# Altium schematic sheet Boom Deployment.SchDoc
size A3; SheetNumber: 5; SheetTotal: 5
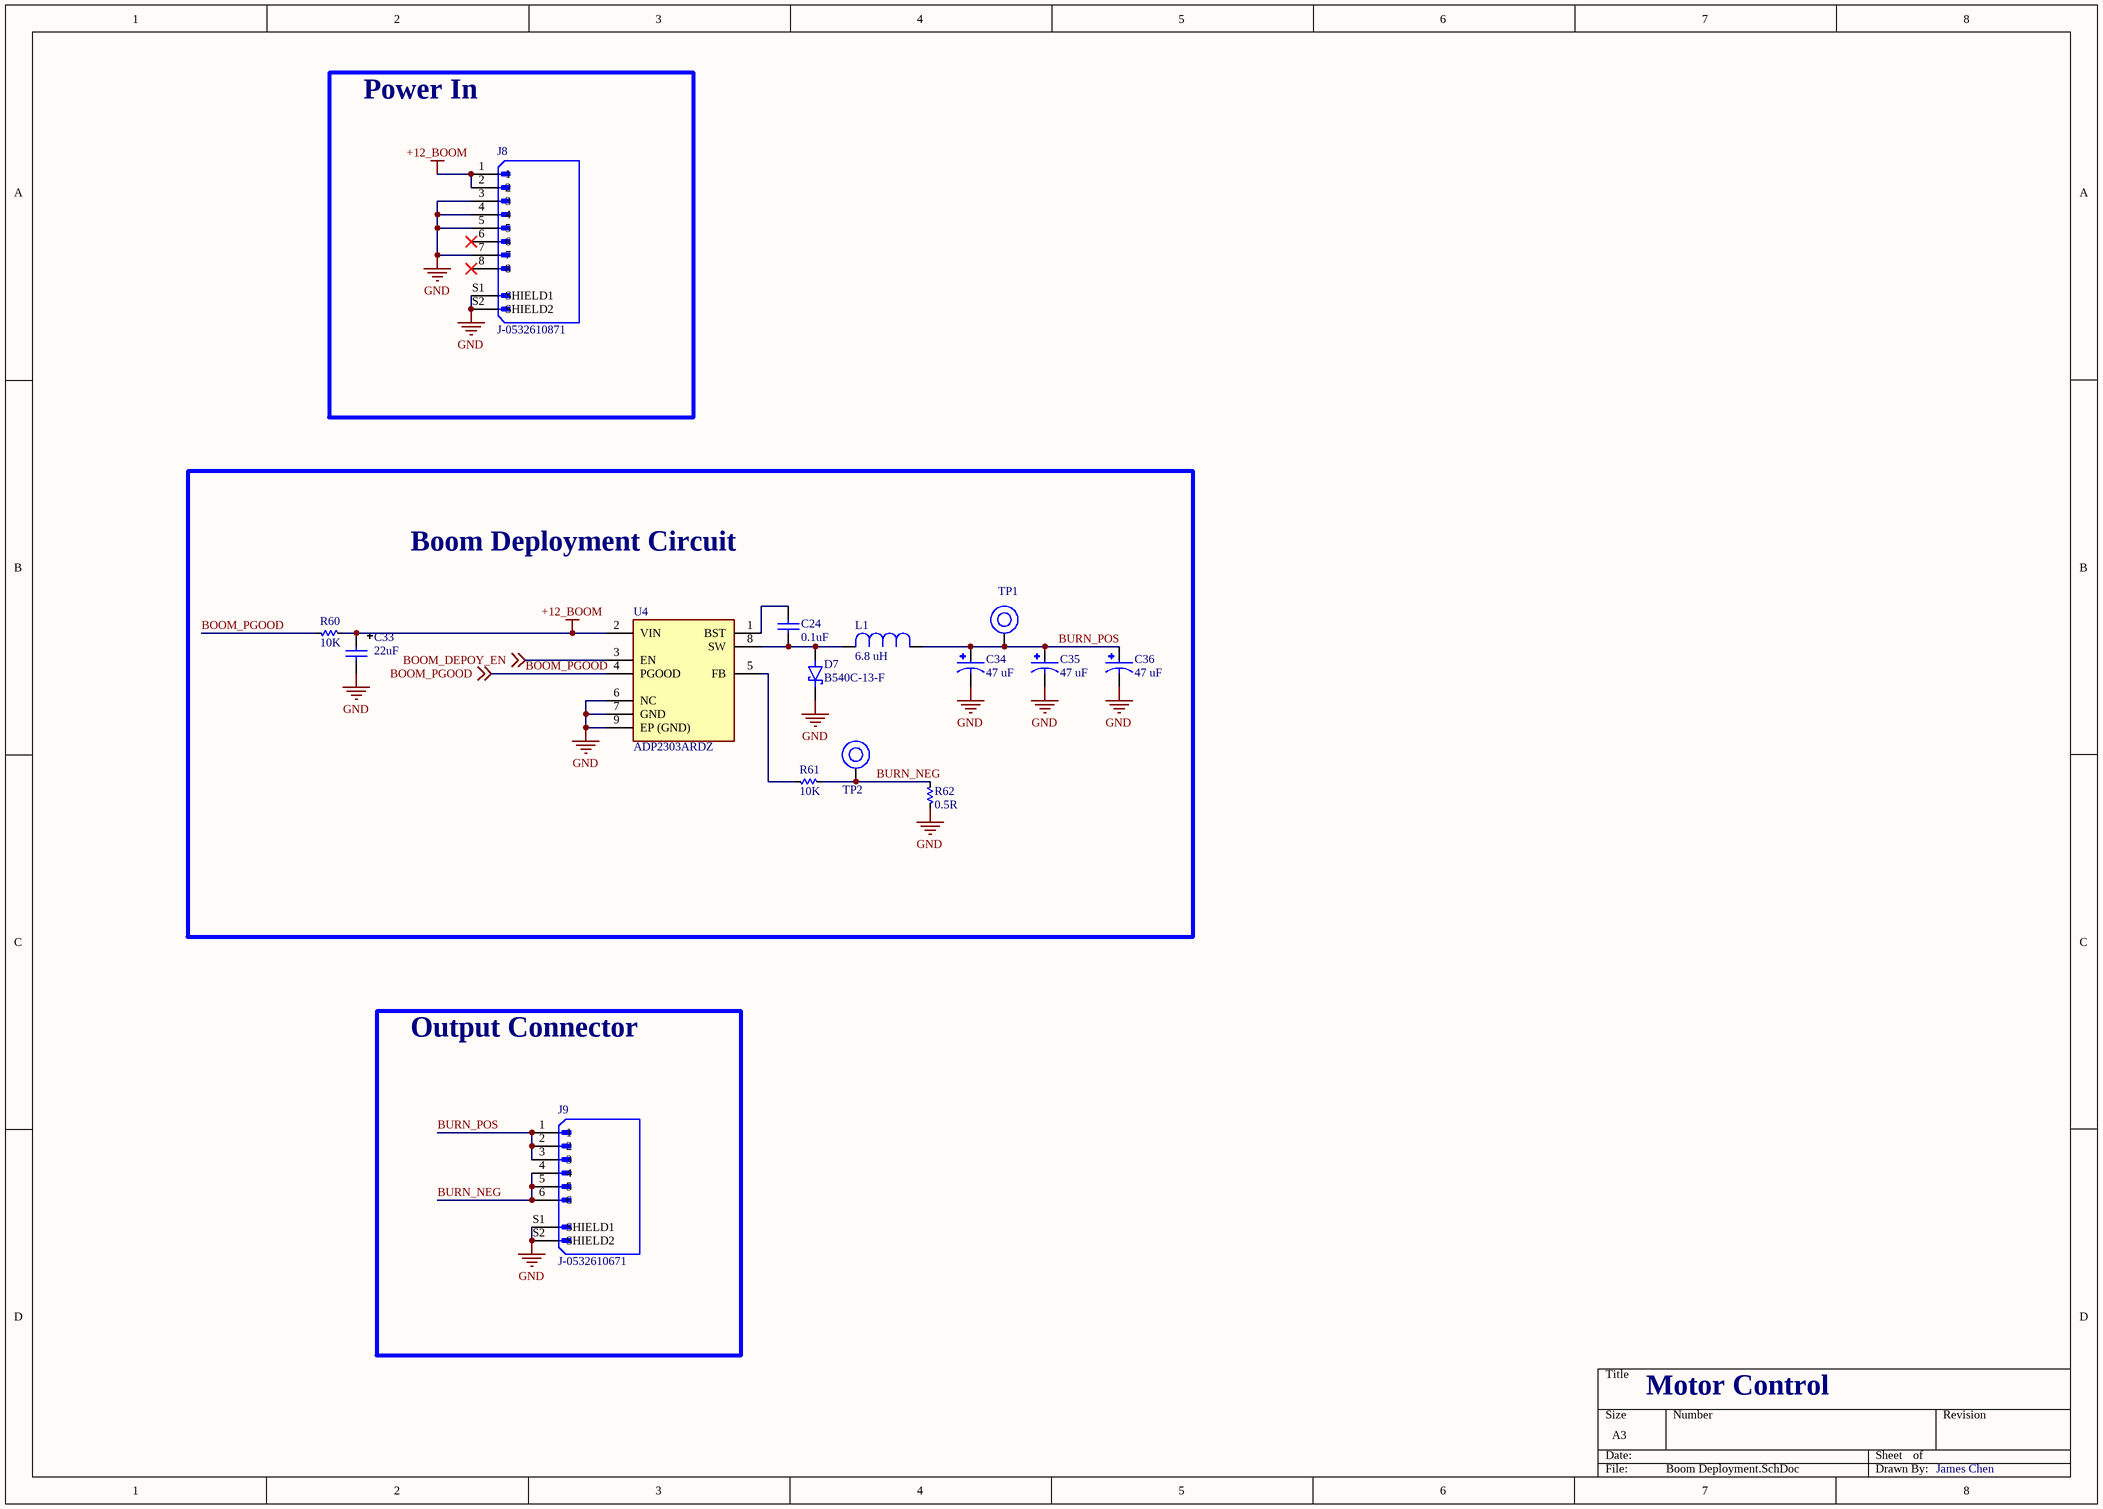
[diagram p0: Boom Deployment.SchDoc]

## Parts
C24  0.1uF  [0603]
C33  22uF  [CAP TANT 1206 (A) TCJ]
C34  47 uF  [CC-25SVPF47M]
C35  47 uF  [CC-25SVPF47M]
C36  47 uF  [CC-25SVPF47M]
D7  B540C-13-F  [D-B540C-13-F]
J8  J-0532610871  [J-532610871]
J9  J-0532610671  [J-0532610671]
L1  6.8 UH  [L-IHLP4040DZER6R8M01]
R60  10K  [0603]
R61  10K  [0603]
R62  0.5R  [2010]
TP1  TP  [TP]  (value not drawn)
TP2  TP  [TP]  (value not drawn)
U4  ADP2303ARDZ  [U-ADP2303ARDZ]

## Blocks framed on the sheet
Power In: J8
Boom Deployment Circuit: C24 C33-C36 D7 L1 R60-R62 TP1 TP2 U4
Output Connector: J9

## Nets
+12_BOOM: C33.1 J8.1 J8.2 R60.2 U4.2(VIN)
GND: C33.2 C34.2 C35.2 C36.2 D7.C(K) J8.3 J8.4 J8.5 J8.7 J8.S1(SHIELD1) J8.S2(SHIELD2) J9.S1(SHIELD1) J9.S2(SHIELD2) R62.1 U4.6(NC) U4.7(GND) U4.9(EP_(GND))
BOOM_DEPOY_EN: U4.3(EN) ; off-sheet BOOM_DEPOY_EN
BOOM_PGOOD: R60.1 U4.4(PGOOD) ; off-sheet BOOM_PGOOD
BURN_NEG: J9.4 J9.5 J9.6 R61.2 R62.2 TP2.1
BURN_POS: C34.1 C35.1 C36.1 J9.1 J9.2 J9.3 L1.1 TP1.1
NetC24_1: C24.1 D7.A L1.2 U4.8(SW)
NetC24_2: C24.2 U4.1(BST)
NetR61_1: R61.1 U4.5(FB)

Not connected (* = marked no-connect by the designer): J8 6* 8*

## Notes on the sheet
- Motor Control
- James Chen

## Library data of the parts
C24 = CC-104-K-25V-X7R-0603: 0.1 µF ±10% 25V Ceramic Capacitor X7R 0603 (1608 Metric); Manufacturer: Samsung Electro-Mechanics; Manufacturer Part #: CL10B104KA8NNNC; ComponentLink1description: Datasheet; ComponentLink1URL: https://ds.yuden.co.jp/TYCOMPAS/ut/detail?pn=TMK105BJ104KV-F%20%20&u=M; ComponentLink2description: Manufacturer Website; Distributor: Digikey; Distributor Part #: 1276-1006-1-ND; Part Description: 0.1 µF ±10% 25V Ceramic Capacitor X7R 0603 (1608 Metric); ComponentLink2URL: https://www.yuden.co.jp/or/; Value: 0.1uF
C33 = CT-225-M-20V-OTH-1206: CAP TANT 22UF 10% 10V 1206; Manufacturer: KYOCERA AVX; Manufacturer Part #: TPSA226K010T0900; ComponentLink1Description: Datasheet; ComponentLink1URL: *; ComponentLink2Description: Manufacturer Website; ComponentLink2URL: *; Distributor: Digikey; Distributor Part #: 478-11193-1-ND; Part Description: CAP TANT 22UF 10% 10V 1206; Value: 22uF
C34-C36 = CC-25SVPF47M: CAP ALUM POLY 47UF 20% 25V SMD; Manufacturer: Panasonic Electronic Components; ComponentLink1Description: Datasheet; ComponentLink1URL: *; ComponentLink2Description: Manufacture Website; ComponentLink2URL: *; Distributor: Digikey; Distributor Part #: P16513CT-ND; Manufacturer Part #: 25SVPF47M; Part Description: CAP ALUM POLY 47UF 20% 25V SMD; Value: 47 uF
D7 = D-B540C-13-F: DIODE SCHOTTKY 40V 5A SMC; Manufacturer: Diodes Incorporated; Manufacturer Part #: B540C-13-F; Distributor Part #: B540C-FDICT-ND; Distributor: Digikey
J8 = J-0532610871: CONN HEADER SMD R/A 8POS 1.25MM; Manfacturer: Molex; Manfacturer Part #: 0532610871; Distributor Part #: WM7626CT-ND; Distributor: Digi-Key
J9 = J-0532610671: CONN HEADER SMD R/A 6POS 1.25MM; Manfacturer: Molex; Distributor: Digi-Key; Manfacturer Part #: 0532610671; Distributor Part #: WM7624CT-ND
L1 = L-IHLP4040DZER6R8M01: FIXED IND 6.8UH 8A 23.3 MOHM SMD; Manufacturer: Vishay Dale; Manufacturer Part #: IHLP4040DZER6R8M01; Distributor Part #: 541-1303-1-ND; Distributor: Digikey; Value: 6.8 uH
R60 R61 = RT-10K0-F-1/16W-0603: RES 10K OHM 1% 1/8W 0603; Manufacturer: Stackpole Electronics Inc; Manufacturer Part #: RNCP0603FTD10K0; ComponentLink1description: Datasheet; ComponentLink1URL: https://www.vishay.com/docs/20035/dcrcwe3.pdf; ComponentLink2description: Manufacturer Website; Distributor: Digikey; Distributor Part #: RNCP0603FTD10K0CT-ND; Part Description: RES 10K OHM 1% 1/8W 0603; ComponentLink2URL: https://www.vishay.com/; Value: 10K
R62 = RT-0.5R0-F-1W-2010: RES 0.5 OHM 1% 1W 2010; Manufacturer: Vishay Dale; Manufacturer Part #: WSLT2010R5000FEA18; ComponentLink1description: Datasheet; ComponentLink1URL: https://www.vishay.com/docs/20035/dcrcwe3.pdf; ComponentLink2description: Manufacturer Website; Distributor: Digikey; Distributor Part #: 541-10112-1-ND; Part Description: RES 0.5 OHM 1% 1W 2010; ComponentLink2URL: https://www.vishay.com/; Value: 0.5R
TP1 TP2 = TP: Test Point; ComponentLink1description: Datasheet; ComponentLink1URL: https://industrial.panasonic.com/ww/products/resistors/chip-resistors/general-purpose-chip-resistors/models/ERJ2GE0R00X; ComponentLink2description: Manufacturer Website; ComponentLink2URL: https://industrial.panasonic.com/ww/products/resistors/chip-resistors/general-purpose-chip-resistors/models/ERJ2GE0R00X
U4 = U-ADP2303ARDZ: IC REG BUCK ADJUSTABLE 3A 8SOIC; Manufacturer: Analog Devices Inc.; Manufacturer Part #: ADP2303ARDZ; Distributor: Digikey; Distributor Part #: 505-ADP2303ARDZ-ND